# Altium schematic sheet LpGBT-Elinks.SchDoc: lpGBT Elinks
size A; DocumentNumber: 11; SheetNumber: 11; SheetTotal: 22
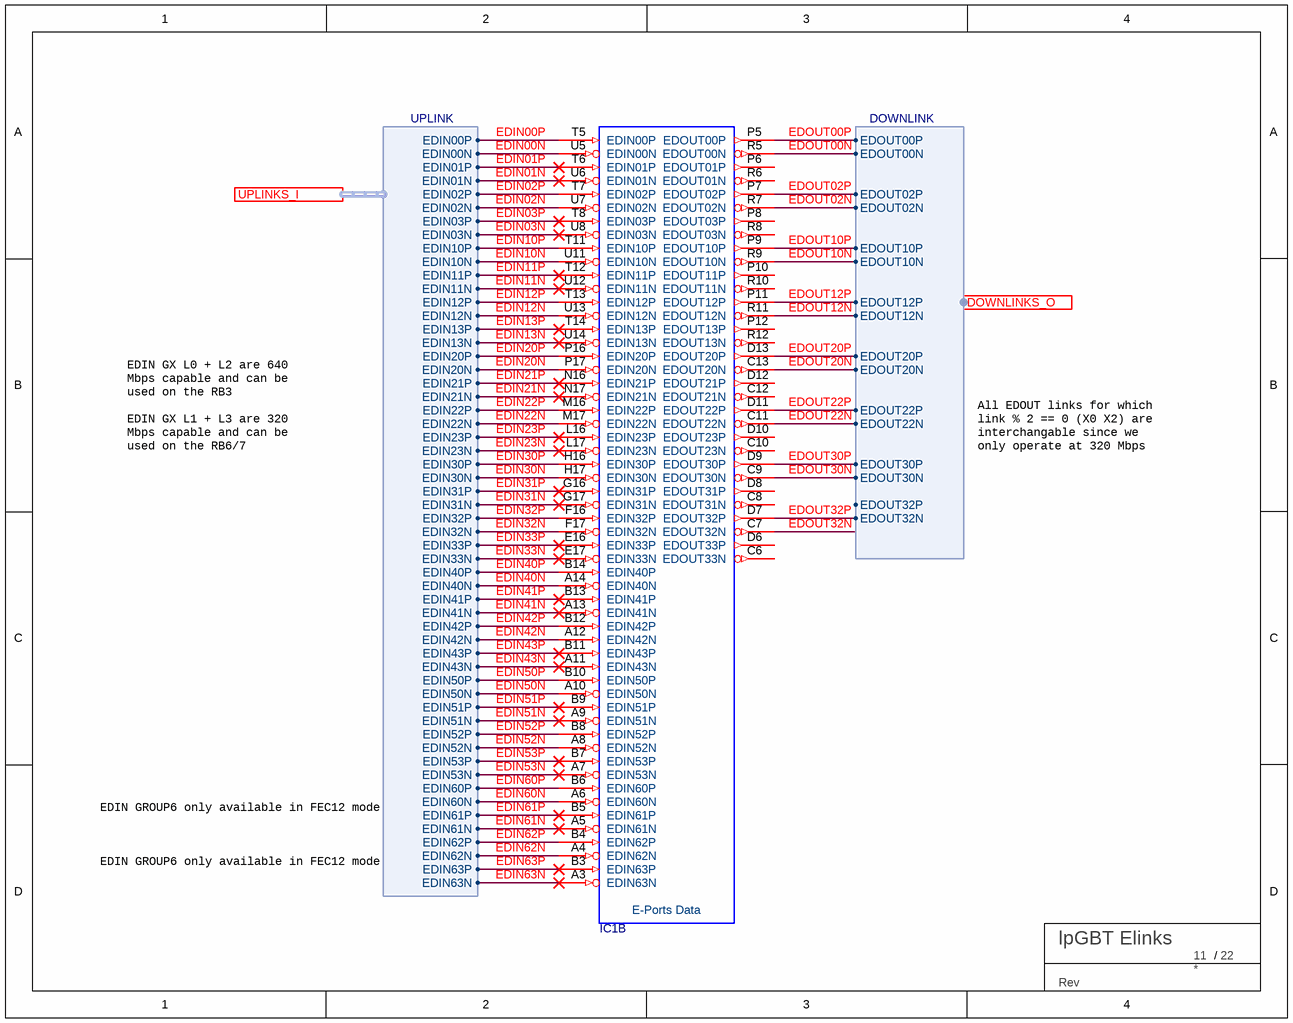
[diagram p0: LpGBT-Elinks.SchDoc]

## Parts
IC1  LPGBT  [BGA289X17]  (value not drawn)  (part B of 8)
TBLOCK?  BU Title block  (value not drawn)  (graphical)

## Ports
DOWNLINKS_O (harness DOWNLINK), UPLINKS_I (harness UPLINK)

## Harnesses
UPLINK: EDIN00P, EDIN00N, EDIN02P, EDIN02N, EDIN10P, EDIN10N, EDIN12P, EDIN12N, EDIN20P, EDIN20N, EDIN22P, EDIN22N, EDIN30P, EDIN30N, EDIN32P, EDIN32N, EDIN40P, EDIN42P, EDIN50P, EDIN52P, EDIN52N, EDIN50N, EDIN42N, EDIN40N, EDIN60P, EDIN60N, EDIN62P, EDIN62N, EDIN01P, EDIN01N, EDIN03P, EDIN03N, EDIN11P, EDIN11N, EDIN13P, EDIN13N, EDIN21P, EDIN21N, EDIN23P, EDIN23N, EDIN31P, EDIN31N, EDIN33P, EDIN33N, EDIN41P, EDIN43P, EDIN51P, EDIN53P, EDIN53N, EDIN51N, EDIN43N, EDIN41N, EDIN61P, EDIN61N, EDIN63P, EDIN63N
DOWNLINK: EDOUT30N, EDOUT30P, EDOUT22N, EDOUT22P, EDOUT20N, EDOUT20P, EDOUT12N, EDOUT10N, EDOUT02N, EDOUT00N, EDOUT00P, EDOUT02P, EDOUT10P, EDOUT12P, EDOUT32N, EDOUT32P

## Nets
EDIN00N: IC1.U5(EDIN00N) ; port UPLINKS_I.EDIN00N
EDIN00P: IC1.T5(EDIN00P) ; port UPLINKS_I.EDIN00P
EDIN01N: IC1.U6(EDIN01N) ; port UPLINKS_I.EDIN01N
EDIN01P: IC1.T6(EDIN01P) ; port UPLINKS_I.EDIN01P
EDIN02N: IC1.U7(EDIN02N) ; port UPLINKS_I.EDIN02N
EDIN02P: IC1.T7(EDIN02P) ; port UPLINKS_I.EDIN02P
EDIN03N: IC1.U8(EDIN03N) ; port UPLINKS_I.EDIN03N
EDIN03P: IC1.T8(EDIN03P) ; port UPLINKS_I.EDIN03P
EDIN10N: IC1.U11(EDIN10N) ; port UPLINKS_I.EDIN10N
EDIN10P: IC1.T11(EDIN10P) ; port UPLINKS_I.EDIN10P
EDIN11N: IC1.U12(EDIN11N) ; port UPLINKS_I.EDIN11N
EDIN11P: IC1.T12(EDIN11P) ; port UPLINKS_I.EDIN11P
EDIN12N: IC1.U13(EDIN12N) ; port UPLINKS_I.EDIN12N
EDIN12P: IC1.T13(EDIN12P) ; port UPLINKS_I.EDIN12P
EDIN13N: IC1.U14(EDIN13N) ; port UPLINKS_I.EDIN13N
EDIN13P: IC1.T14(EDIN13P) ; port UPLINKS_I.EDIN13P
EDIN20N: IC1.P17(EDIN20N) ; port UPLINKS_I.EDIN20N
EDIN20P: IC1.P16(EDIN20P) ; port UPLINKS_I.EDIN20P
EDIN21N: IC1.N17(EDIN21N) ; port UPLINKS_I.EDIN21N
EDIN21P: IC1.N16(EDIN21P) ; port UPLINKS_I.EDIN21P
EDIN22N: IC1.M17(EDIN22N) ; port UPLINKS_I.EDIN22N
EDIN22P: IC1.M16(EDIN22P) ; port UPLINKS_I.EDIN22P
EDIN23N: IC1.L17(EDIN23N) ; port UPLINKS_I.EDIN23N
EDIN23P: IC1.L16(EDIN23P) ; port UPLINKS_I.EDIN23P
EDIN30N: IC1.H17(EDIN30N) ; port UPLINKS_I.EDIN30N
EDIN30P: IC1.H16(EDIN30P) ; port UPLINKS_I.EDIN30P
EDIN31N: IC1.G17(EDIN31N) ; port UPLINKS_I.EDIN31N
EDIN31P: IC1.G16(EDIN31P) ; port UPLINKS_I.EDIN31P
EDIN32N: IC1.F17(EDIN32N) ; port UPLINKS_I.EDIN32N
EDIN32P: IC1.F16(EDIN32P) ; port UPLINKS_I.EDIN32P
EDIN33N: IC1.E17(EDIN33N) ; port UPLINKS_I.EDIN33N
EDIN33P: IC1.E16(EDIN33P) ; port UPLINKS_I.EDIN33P
EDIN40N: IC1.A14(EDIN40N) ; port UPLINKS_I.EDIN40N
EDIN40P: IC1.B14(EDIN40P) ; port UPLINKS_I.EDIN40P
EDIN41N: IC1.A13(EDIN41N) ; port UPLINKS_I.EDIN41N
EDIN41P: IC1.B13(EDIN41P) ; port UPLINKS_I.EDIN41P
EDIN42N: IC1.A12(EDIN42N) ; port UPLINKS_I.EDIN42N
EDIN42P: IC1.B12(EDIN42P) ; port UPLINKS_I.EDIN42P
EDIN43N: IC1.A11(EDIN43N) ; port UPLINKS_I.EDIN43N
EDIN43P: IC1.B11(EDIN43P) ; port UPLINKS_I.EDIN43P
EDIN50N: IC1.A10(EDIN50N) ; port UPLINKS_I.EDIN50N
EDIN50P: IC1.B10(EDIN50P) ; port UPLINKS_I.EDIN50P
EDIN51N: IC1.A9(EDIN51N) ; port UPLINKS_I.EDIN51N
EDIN51P: IC1.B9(EDIN51P) ; port UPLINKS_I.EDIN51P
EDIN52N: IC1.A8(EDIN52N) ; port UPLINKS_I.EDIN52N
EDIN52P: IC1.B8(EDIN52P) ; port UPLINKS_I.EDIN52P
EDIN53N: IC1.A7(EDIN53N) ; port UPLINKS_I.EDIN53N
EDIN53P: IC1.B7(EDIN53P) ; port UPLINKS_I.EDIN53P
EDIN60N: IC1.A6(EDIN60N) ; port UPLINKS_I.EDIN60N
EDIN60P: IC1.B6(EDIN60P) ; port UPLINKS_I.EDIN60P
EDIN61N: IC1.A5(EDIN61N) ; port UPLINKS_I.EDIN61N
EDIN61P: IC1.B5(EDIN61P) ; port UPLINKS_I.EDIN61P
EDIN62N: IC1.A4(EDIN62N) ; port UPLINKS_I.EDIN62N
EDIN62P: IC1.B4(EDIN62P) ; port UPLINKS_I.EDIN62P
EDIN63N: IC1.A3(EDIN63N) ; port UPLINKS_I.EDIN63N
EDIN63P: IC1.B3(EDIN63P) ; port UPLINKS_I.EDIN63P
EDOUT00N: IC1.R5(EDOUT00N) ; port DOWNLINKS_O.EDOUT00N
EDOUT00P: IC1.P5(EDOUT00P) ; port DOWNLINKS_O.EDOUT00P
EDOUT02N: IC1.R7(EDOUT02N) ; port DOWNLINKS_O.EDOUT02N
EDOUT02P: IC1.P7(EDOUT02P) ; port DOWNLINKS_O.EDOUT02P
EDOUT10N: IC1.R9(EDOUT10N) ; port DOWNLINKS_O.EDOUT10N
EDOUT10P: IC1.P9(EDOUT10P) ; port DOWNLINKS_O.EDOUT10P
EDOUT12N: IC1.R11(EDOUT12N) ; port DOWNLINKS_O.EDOUT12N
EDOUT12P: IC1.P11(EDOUT12P) ; port DOWNLINKS_O.EDOUT12P
EDOUT20N: IC1.C13(EDOUT20N) ; port DOWNLINKS_O.EDOUT20N
EDOUT20P: IC1.D13(EDOUT20P) ; port DOWNLINKS_O.EDOUT20P
EDOUT22N: IC1.C11(EDOUT22N) ; port DOWNLINKS_O.EDOUT22N
EDOUT22P: IC1.D11(EDOUT22P) ; port DOWNLINKS_O.EDOUT22P
EDOUT30N: IC1.C9(EDOUT30N) ; port DOWNLINKS_O.EDOUT30N
EDOUT30P: IC1.D9(EDOUT30P) ; port DOWNLINKS_O.EDOUT30P
EDOUT32N: IC1.C7(EDOUT32N)
EDOUT32P: IC1.D7(EDOUT32P) ; port DOWNLINKS_O.EDOUT32N

Not connected (* = marked no-connect by the designer): IC1 C6(EDOUT33N) C8(EDOUT31N) C10(EDOUT23N) C12(EDOUT21N) D6(EDOUT33P) D8(EDOUT31P) D10(EDOUT23P) D12(EDOUT21P) P6(EDOUT01P) P8(EDOUT03P) P10(EDOUT11P) P12(EDOUT13P) R6(EDOUT01N) R8(EDOUT03N) R10(EDOUT11N) R12(EDOUT13N)

## Notes on the sheet
- EDIN GX L0 + L2 are 640 Mbps capable and can be used on the RB3
  EDIN GX L1 + L3 are 320 Mbps capable and can be used on the RB6/7
- All EDOUT links for which link % 2 == 0 (X0 X2) are interchangable since we only operate at 320 Mbps
- EDIN GROUP6 only available in FEC12 mode
- (in symbol LPGBT, part B) E-Ports Data
- (in symbol TITLE_BLOCK_BU) /; Rev

## Library data of the parts
IC1 = LPGBT: Low Power Gigabit Transceiver; Manufacturer: CERN; Pinout Version: 180226; Bonding: No; Device: LPGBT; Manufacturer Part Number: LPGBT; SMD: Yes; Mounted: Yes; LatestRevisionDate: 26.10.2018; PackageDescription: BGA, 289-Leads, Body 9.00x9.00mmx1.28mm, Pitch 0.50mm; Part Description: Low Power Gigabit Transceiver; Case: BGA289; Part Number: LPGBT; Pin Count: 289; Socket: No; Component Kind: Standard; Component Type: Standard; Footprint: BGA289C50P17X17_900X900X128
TBLOCK? = TITLE_BLOCK_BU